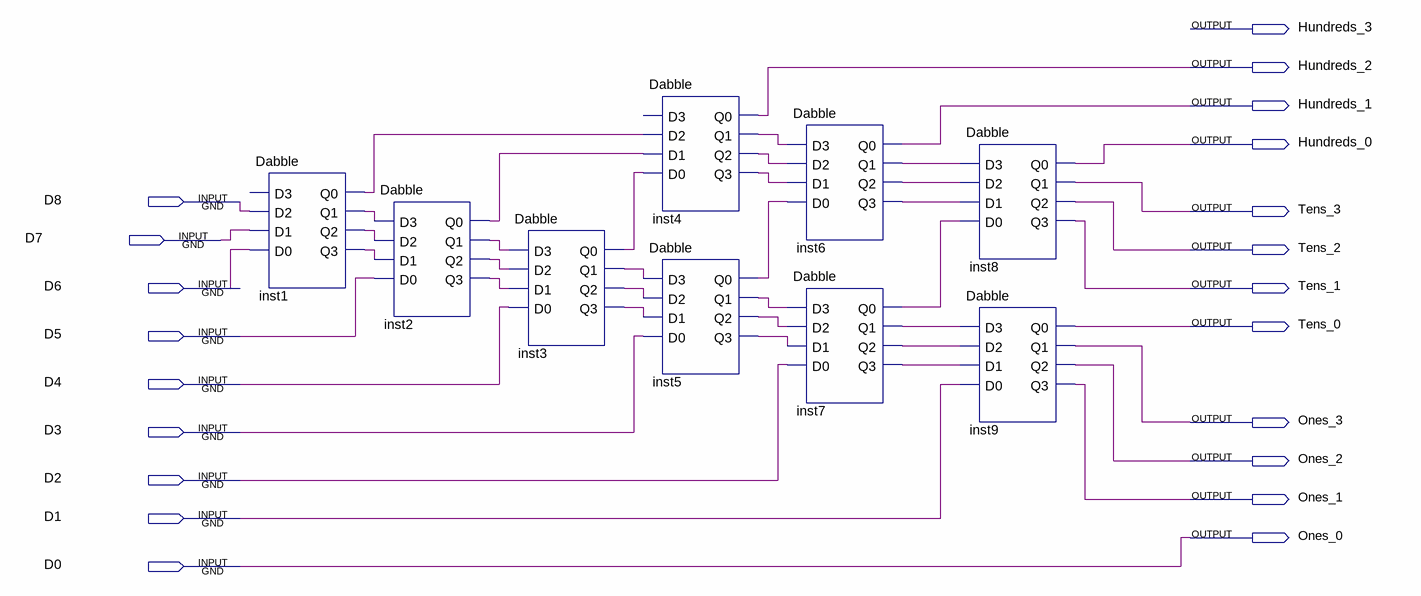
[diagram p0: schematic sheet]
// Quartus schematic Double_Dabble.bdf as structural Verilog: 9 symbols, 21 pins
module Double_Dabble (
  input  D8,
  input  D7,
  input  D6,
  input  D5,
  input  D4,
  input  D3,
  input  D2,
  input  D1,
  input  D0,
  output Hundreds_3,
  output Hundreds_2,
  output Hundreds_1,
  output Hundreds_0,
  output Tens_3,
  output Tens_2,
  output Tens_1,
  output Tens_0,
  output Ones_3,
  output Ones_2,
  output Ones_1,
  output Ones_0
);

  wire inst1_q0, inst1_q1, inst1_q2, inst1_q3, inst2_q0, inst2_q1, inst2_q2, inst2_q3, inst3_q0, inst3_q1,
       inst3_q2, inst3_q3, inst4_q1, inst4_q2, inst4_q3, inst5_q0, inst5_q1, inst5_q2, inst5_q3, inst6_q1,
       inst6_q2, inst6_q3, inst7_q0, inst7_q1, inst7_q2, inst7_q3;

  Dabble inst1 (.D2(D8), .D1(D7), .D0(D6), .Q0(inst1_q0), .Q1(inst1_q1), .Q2(inst1_q2), .Q3(inst1_q3));  // open: D3
  Dabble inst2 (
    .D3(inst1_q1), .D2(inst1_q2), .D1(inst1_q3), .D0(D5), .Q0(inst2_q0), .Q1(inst2_q1), .Q2(inst2_q2),
    .Q3(inst2_q3));
  Dabble inst3 (
    .D3(inst2_q1), .D2(inst2_q2), .D1(inst2_q3), .D0(D4), .Q0(inst3_q0), .Q1(inst3_q1), .Q2(inst3_q2),
    .Q3(inst3_q3));
  Dabble inst4 (
    .D2(inst1_q0), .D1(inst2_q0), .D0(inst3_q0), .Q0(Hundreds_2), .Q1(inst4_q1), .Q2(inst4_q2), .Q3(inst4_q3));  // open: D3
  Dabble inst5 (
    .D3(inst3_q1), .D2(inst3_q2), .D1(inst3_q3), .D0(D3), .Q0(inst5_q0), .Q1(inst5_q1), .Q2(inst5_q2),
    .Q3(inst5_q3));
  Dabble inst6 (
    .D3(inst4_q1), .D2(inst4_q2), .D1(inst4_q3), .D0(inst5_q0), .Q0(Hundreds_1), .Q1(inst6_q1),
    .Q2(inst6_q2), .Q3(inst6_q3));
  Dabble inst7 (
    .D3(inst5_q1), .D2(inst5_q2), .D1(inst5_q3), .D0(D2), .Q0(inst7_q0), .Q1(inst7_q1), .Q2(inst7_q2),
    .Q3(inst7_q3));
  Dabble inst8 (
    .D3(inst6_q1), .D2(inst6_q2), .D1(inst6_q3), .D0(inst7_q0), .Q0(Hundreds_0), .Q1(Tens_3), .Q2(Tens_2),
    .Q3(Tens_1));
  Dabble inst9 (
    .D3(inst7_q1), .D2(inst7_q2), .D1(inst7_q3), .D0(D1), .Q0(Tens_0), .Q1(Ones_3), .Q2(Ones_2), .Q3(Ones_1));

  assign Ones_0 = D0;
endmodule
